# Altium schematic sheet Top.SchDoc
size A4; SheetNumber: 1; SheetTotal: 3
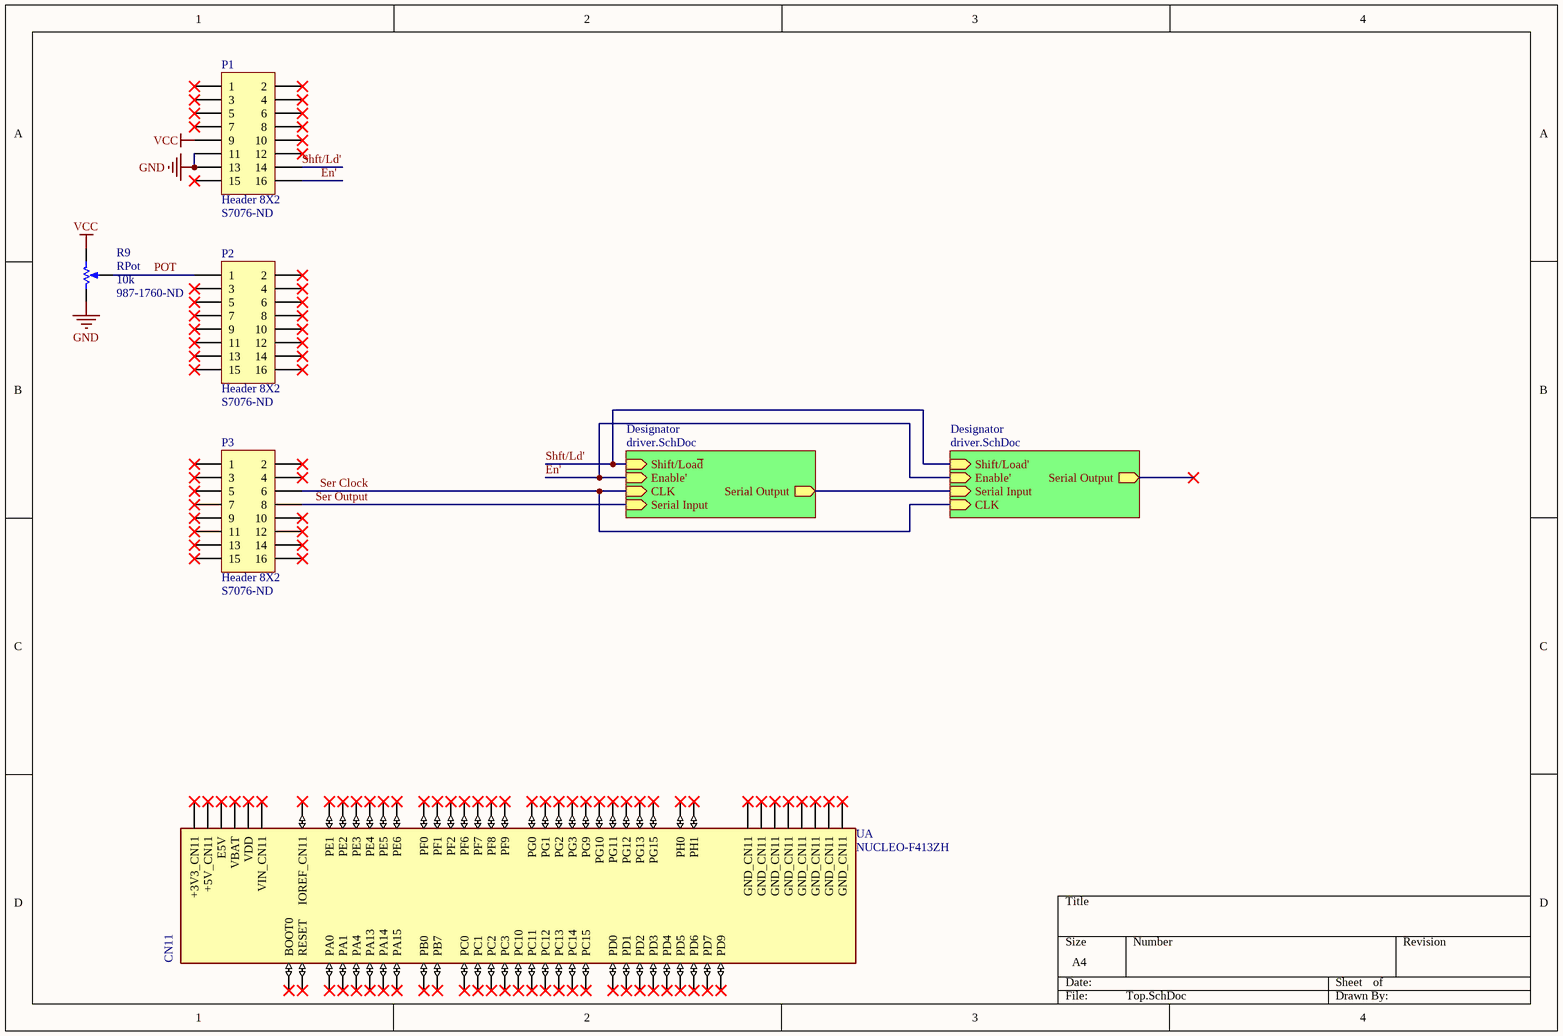
[diagram p0: Top.SchDoc]

## Parts
P1  Header 8X2  Supplier Part Number 1: S7076-ND  [HDR2X8]
P2  Header 8X2  Supplier Part Number 1: S7076-ND  [HDR2X8]
P3  Header 8X2  Supplier Part Number 1: S7076-ND  [HDR2X8]
R9  RPot  value 10k  Supplier Part Number 1: 987-1760-ND  [VR5]
U  NUCLEO-F413ZH  [ST_NUCLEO-F413ZH]  (part A of 6)

## Sub-sheets
Designator = driver.SchDoc: Serial Output (out), Serial Input (in), CLK (in), Enable' (in), Shift/Loa~{d} (in)
Designator = driver.SchDoc: Serial Output (out), Serial Input (in), CLK (in), Enable' (in), Shift/Load' (in)

## Nets
GND: P1.11 P1.13 R9.2(BOT)
VCC: P1.9 R9.1(TOP)
En': P1.16 ; sheet Designator/Enable', sheet Designator/Enable'
POT: P2.1 R9.3(TAP)
Ser Clock: P3.6 ; sheet Designator/CLK, sheet Designator/CLK
Ser Output: P3.8 ; sheet Designator/Serial Input
Shft/Ld': P1.14 ; sheet Designator/Shift/Loa~{d}, sheet Designator/Shift/Load'
(unnamed): sheet Designator/Serial Output, sheet Designator/Serial Input

Not connected (* = marked no-connect by the designer): P1 1* 2* 3* 4* 5* 6* 7* 8* 10* 12* 15*; P2 2* 3* 4* 5* 6* 7* 8* 9* 10* 11* 12* 13* 14* 15* 16*; P3 1* 2* 3* 4* 5* 7* 9* 10* 11* 12* 13* 14* 15* 16*; U CN11_1(PC10)* CN11_2(PC11)* CN11_3(PC12)* CN11_4(PD2)* CN11_5(VDD)* CN11_6(E5V)* CN11_7(BOOT0)* CN11_8(GND_CN11)* CN11_9(PF6)* CN11_11(PF7)* CN11_12(IOREF_CN11)* CN11_13(PA13)* CN11_14(RESET)* CN11_15(PA14)* CN11_16(+3V3_CN11)* CN11_17(PA15)* CN11_18(+5V_CN11)* CN11_19(GND_CN11)* CN11_20(GND_CN11)* CN11_21(PB7)* CN11_22(GND_CN11)* CN11_23(PC13)* CN11_24(VIN_CN11)* CN11_25(PC14)* CN11_27(PC15)* CN11_28(PA0)* CN11_29(PH0)* CN11_30(PA1)* CN11_31(PH1)* CN11_32(PA4)* CN11_33(VBAT)* CN11_34(PB0)* CN11_35(PC2)* CN11_36(PC1)* CN11_37(PC3)* CN11_38(PC0)* CN11_39(PD4)* CN11_40(PD3)* CN11_41(PD5)* CN11_42(PG2)* CN11_43(PD6)* CN11_44(PG3)* CN11_45(PD7)* CN11_46(PE2)* CN11_47(PE3)* CN11_48(PE4)* CN11_49(GND_CN11)* CN11_50(PE5)* CN11_51(PF1)* CN11_52(PF2)* CN11_53(PF0)* CN11_54(PF8)* CN11_55(PD1)* CN11_56(PF9)* CN11_57(PD0)* CN11_58(PG1)* CN11_59(PG0)* CN11_60(GND_CN11)* CN11_61(PE1)* CN11_62(PE6)* CN11_63(PG9)* CN11_64(PG15)* CN11_65(PG12)* CN11_66(PG10)* CN11_68(PG13)* CN11_69(PD9)* CN11_70(PG11)* CN11_71(GND_CN11)* CN11_72(GND_CN11)*

## Notes on the sheet
- (in symbol NUCLEO-F413ZH, part A) CN11

## Library data of the parts
P1-P3 = Header 8X2: Header, 8-Pin, Dual row; LatestRevisionDate: 17-Jul-2002; LatestRevisionNote: Re-released for DXP Platform.; Publisher: Altium Limited; Supplier 1: Digi-Key
R9 = RPot: Potentiometer; Sim Note: Enter the Resistance value and the set point into parameter fields.; Set Position: 0.5; Published: 8-Jun-2000; LatestRevisionDate: 17-Jul-2002; LatestRevisionNote: Re-released for DXP Platform.; PackageReference: VR5; Publisher: Altium Limited; PackageDescription: Variable Resistor, Thru-Hole; 3 Leads; Supplier 1: Digi-Key
U = NUCLEO-F413ZH: STM32F413ZH, mbed-Enabled Development Nucleo-144 STM32F4 ARMÂ® CortexÂ®-M4 MCU 32-Bit Embedded Evaluation Board; MF: STMicroelectronics; Availability: Unavailable; SnapEDA_Link: https://www.snapeda.com/parts/NUCLEO-F413ZH/STMicroelectronics/view-part/586867/?ref=snap; MP: NUCLEO-F413ZH; Price: None; Package: None; Value: *